# Altium schematic sheet SD&Smart Card.SchDoc
size A4; Revision: D.1(PCB.SCH)
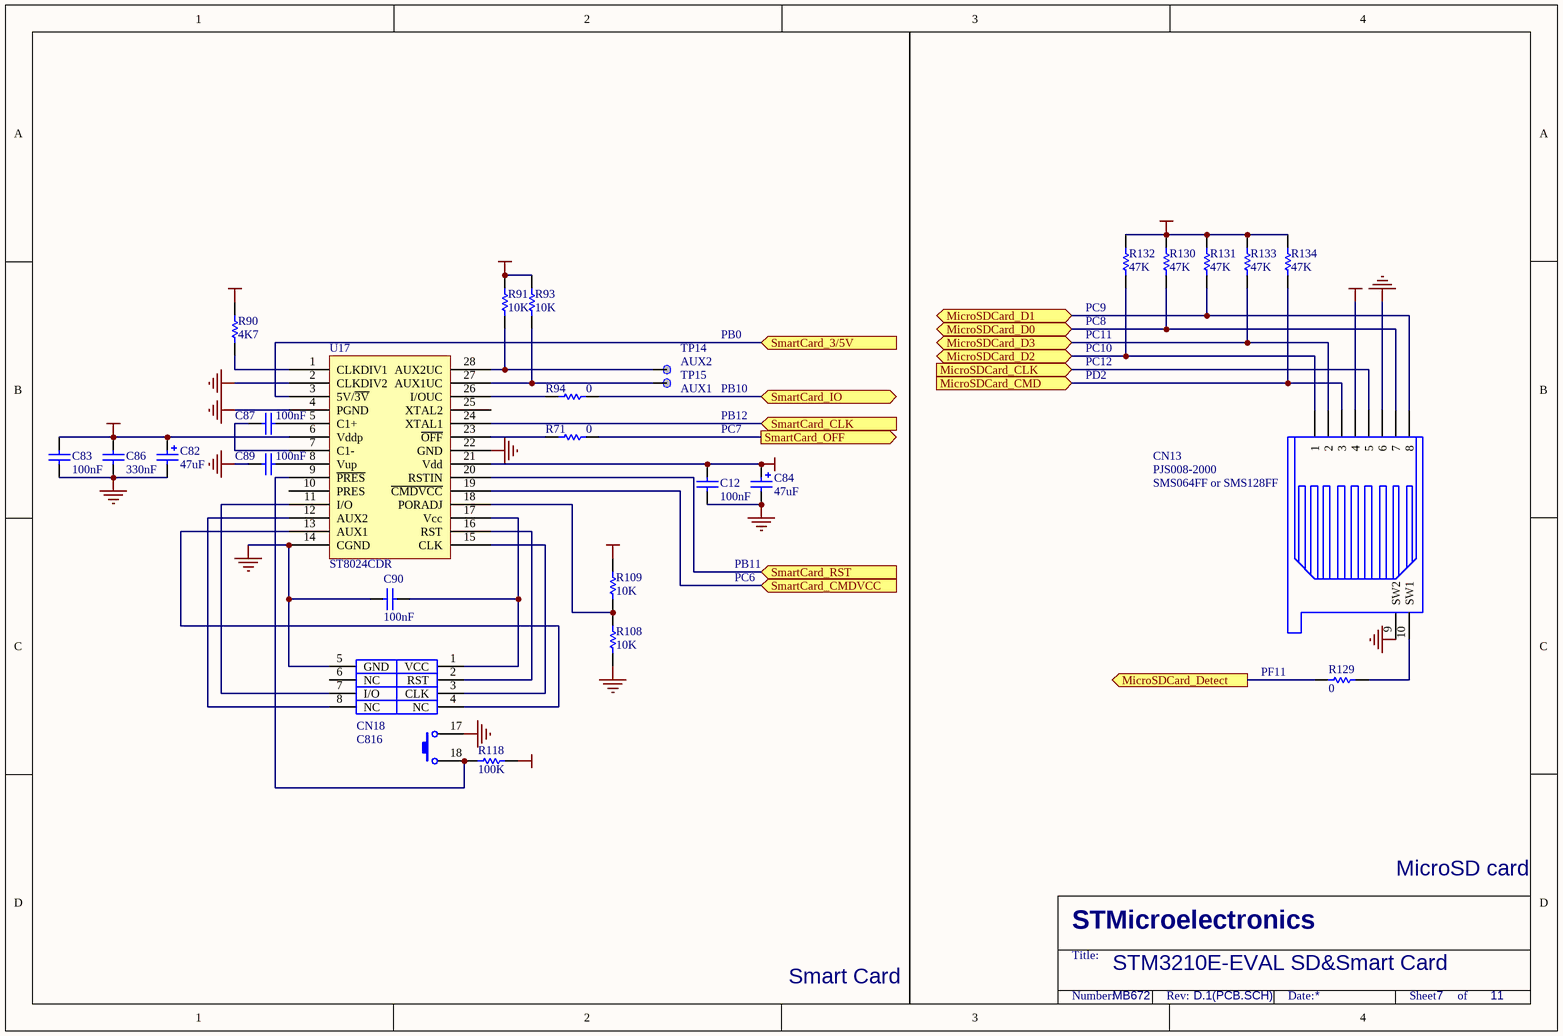
[diagram p0: SD&Smart Card.SchDoc]

## Parts
C12  100nF  [0603P]
C82  47uF  [TAN-B]
C83  100nF  [0603P]
C84  47uF  [TAN-B]
C86  330nF  [0603]
C87  100nF  [0603P]
C89  100nF  [0603P]
C90  100nF  [0603P]
CN13  PJS008-2000  [MSD(PJS008)]
CN18  C816  [SAM(C816)]
R71  0  [0805]
R90  4K7  [0603]
R91  10K  [0603]
R93  10K  [0603]
R94  0  [0805]
R108  10K  [0603]
R109  10K  [0603]
R118  100K  [0603]
R129  0  [0603]
R130  47K  [0805]
R131  47K  [0805]
R132  47K  [0805]
R133  47K  [0805]
R134  47K  [0805]
TP14  AUX2  [TP]
TP15  AUX1  [TP]
U17  ST8024CDR  [SO28]

## Ports
MicroSDCard_CLK (in), MicroSDCard_CMD (in), MicroSDCard_D0 (bidir), MicroSDCard_D1 (bidir), MicroSDCard_D2 (bidir), MicroSDCard_D3 (bidir), MicroSDCard_Detect (out), SmartCard_3/5V (in), SmartCard_CLK (in), SmartCard_CMDVCC (in), SmartCard_IO (bidir), SmartCard_OFF (out), SmartCard_RST (in)

## Nets
+3V3: C12.1 C84.1 CN13.4 R90.1 R91.1 R93.1 R109.1 R118.1 R130.1 R131.1 R132.1 R133.1 R134.1 U17.21(Vdd)
+5V: C82.1 C83.1 C86.1 U17.6(Vddp)
GND: C12.2 C82.2 C83.2 C84.2 C86.2 C89.2 C90.1 CN13.6 CN13.9(SW2) CN18.5(GND) CN18.17 R108.2 U17.2(CLKDIV2) U17.4(PGND) U17.14(CGND) U17.22(GND)
MicroSDCard_CLK: CN13.5 ; port MicroSDCard_CLK
MicroSDCard_CMD: CN13.3 R134.2 ; port MicroSDCard_CMD
MicroSDCard_D0: CN13.7 R130.2 ; port MicroSDCard_D0
MicroSDCard_D1: CN13.8 R131.2 ; port MicroSDCard_D1
MicroSDCard_D2: CN13.1 R132.2 ; port MicroSDCard_D2
MicroSDCard_D3: CN13.2 R133.2 ; port MicroSDCard_D3
MicroSDCard_Detect: R129.1 ; port MicroSDCard_Detect
SmartCard_3/5V: U17.3(5V/~{3V}) ; port SmartCard_3/5V
SmartCard_CLK: U17.24(XTAL1) ; port SmartCard_CLK
SmartCard_CMDVCC: U17.19(~{CMDVCC}) ; port SmartCard_CMDVCC
SmartCard_IO: R94.2 ; port SmartCard_IO
SmartCard_OFF: R71.1 ; port SmartCard_OFF
SmartCard_RST: U17.20(RSTIN) ; port SmartCard_RST
NetC87_1: C87.1 U17.7(C1-)
NetC87_2: C87.2 U17.5(C1+)
NetC89_1: C89.1 U17.8(Vup)
NetC90_2: C90.2 CN18.1(VCC) U17.17(Vcc)
NetCN13_10: CN13.10(SW1) R129.2
NetCN18_2: CN18.2(RST) U17.16(RST)
NetCN18_3: CN18.3(CLK) U17.15(CLK)
NetCN18_4: CN18.4(NC) U17.13(AUX1)
NetCN18_7: CN18.7(I/O) U17.11(I/O)
NetCN18_8: CN18.8(NC) U17.12(AUX2)
NetCN18_18: CN18.18 R118.2 U17.9(~{PRES})
NetR71_2: R71.2 U17.23(~{OFF})
NetR90_2: R90.2 U17.1(CLKDIV1)
NetR91_2: R91.2 TP14.1 U17.28(AUX2UC)
NetR93_2: R93.2 TP15.1 U17.27(AUX1UC)
NetR94_1: R94.1 U17.26(I/OUC)
NetR108_1: R108.1 R109.2 U17.18(PORADJ)

Not connected (* = marked no-connect by the designer): CN18 6(NC); U17 10(PRES) 25(XTAL2)

## Notes on the sheet
- (near R132) PC9
- PB0
- (near R132) PC8
- PC10
- PC11
- PD2
- PC12
- PB12
- PC7
- PB10
- (near CN13) SMS064FF or SMS128FF
- PC6
- PB11
- PF11
- MicroSD card
- Smart Card
- STM3210E-EVAL SD&Smart Card
- MB672
- 7
- 11
- STMicroelectronics
- Title:
- Number:
- Rev:
- Date:
- Sheet       of

## Library data of the parts
C12 C83 C87 C89 C90 = CAP: Capacitor; Published: 8-Jun-2000; Revision: July-2002: Re-released for DXP Platform.; Publisher: Altium Limited; Value: 100nF
C82 C84 = Cap Pol1: Polarized Capacitor (Radial); Value: 100pF; Published: 8-Jun-2000; Revision: July-2002: Re-released for DXP Platform.; Publisher: Altium Limited
C86 = CAP: Capacitor; Value: 100nF; Published: 8-Jun-2000; Revision: July-2002: Re-released for DXP Platform.; Publisher: Altium Limited
CN13 = SMS016AFA5E
CN18 = Smart_card_CN
R71 R90 R91 R93 R94 R108 R109 R118 R129-R134 = Res1: Resistor; Value: 1K; Published: 8-Jun-2000; Revision: July-2002: Re-released for DXP Platform.; Publisher: Altium Limited
TP14 TP15 = TP
U17 = ST8024CTR